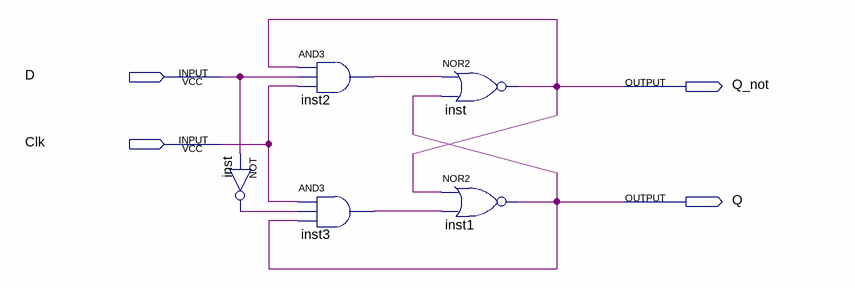
[diagram p0: schematic sheet]
// Quartus schematic D_FlipFlop.bdf as structural Verilog: 5 symbols, 4 pins
module D_FlipFlop (
  input  D,
  input  Clk,
  output Q_not,
  output Q
);

  wire inst2_out, inst3_out, inst_out;

  not inst (inst_out, D);
  and inst2 (inst2_out, Q_not, D, Clk);
  and inst3 (inst3_out, Clk, inst_out, Q);
  nor inst_dup2 (Q_not, inst2_out, Q);
  nor inst1 (Q, Q_not, inst3_out);
endmodule
